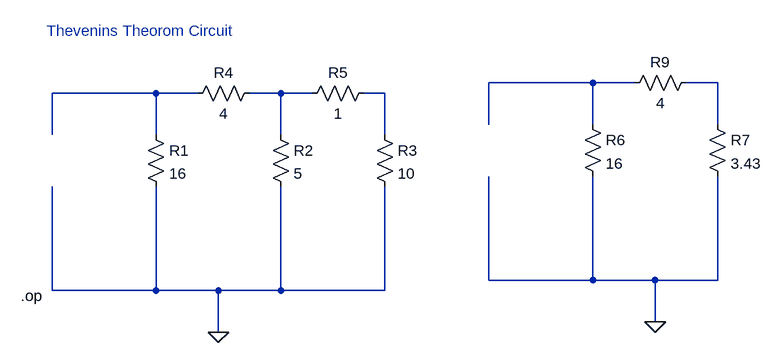
[diagram p0: schematic EEE_1_new_3.asc]
EEE_1_new_3.asc, the LTspice schematic file:
Version 4
SHEET 1 1208 680
WIRE 800 -80 640 -80
WIRE 864 -80 800 -80
WIRE 992 -80 944 -80
WIRE 128 -64 -32 -64
WIRE 192 -64 128 -64
WIRE 320 -64 272 -64
WIRE 368 -64 320 -64
WIRE 480 -64 448 -64
WIRE 640 -16 640 -80
WIRE 800 -16 800 -80
WIRE 992 -16 992 -80
WIRE -32 0 -32 -64
WIRE 128 0 128 -64
WIRE 320 0 320 -64
WIRE 480 0 480 -64
WIRE 640 224 640 64
WIRE 800 224 800 64
WIRE 800 224 640 224
WIRE 896 224 800 224
WIRE 992 224 992 64
WIRE 992 224 896 224
WIRE -32 240 -32 80
WIRE 128 240 128 80
WIRE 128 240 -32 240
WIRE 224 240 128 240
WIRE 320 240 320 80
WIRE 320 240 224 240
WIRE 480 240 480 80
WIRE 480 240 320 240
WIRE 896 288 896 224
WIRE 224 304 224 240
FLAG 224 304 0
FLAG 896 288 0
SYMBOL res 112 -16 R0
SYMATTR InstName R1
SYMATTR Value 16
SYMBOL res 304 -16 R0
SYMATTR InstName R2
SYMATTR Value 5
SYMBOL res 464 -16 R0
SYMATTR InstName R3
SYMATTR Value 10
SYMBOL res 288 -80 R90
WINDOW 0 0 56 VBottom 2
WINDOW 3 32 56 VTop 2
SYMATTR InstName R4
SYMATTR Value 4
SYMBOL res 464 -80 R90
WINDOW 0 0 56 VBottom 2
WINDOW 3 32 56 VTop 2
SYMATTR InstName R5
SYMATTR Value 1
SYMBOL res 784 -32 R0
SYMATTR InstName R6
SYMATTR Value 16
SYMBOL res 976 -32 R0
SYMATTR InstName R7
SYMATTR Value 3.43
SYMBOL res 960 -96 R90
WINDOW 0 0 56 VBottom 2
WINDOW 3 32 56 VTop 2
SYMATTR InstName R9
SYMATTR Value 4
TEXT -80 248 Left 2 !.op
TEXT -40 -160 Left 2 ;Thevenins Theorom Circuit

The netlist it stands for:
* EEE_1_new_3.asc
R1 N003 0 16
R2 N004 0 5
R3 N005 0 10
R4 N004 N003 4
R5 N005 N004 1
R6 N001 0 16
R7 N002 0 3.43
R9 N002 N001 4
.op
* Thevenins Theorom Circuit
.backanno
.end